# Altium project DARKYDEN.PrjPcb (part 8 of 17)

## Sheet SDCARD.SchDoc: DARKYDEN_SDCARD
size Letter; ApprovedBy: APPROUVÉ PAR; Author: Harold Malbrouck; Organization: Cegep Limoilou; Address1: 1300, 8e Avenue; Address2: Québec, QC; Address3: Canada; Address4: G1J 5L5; Revision: Rev.A; SheetNumber: 14; SheetTotal: 23
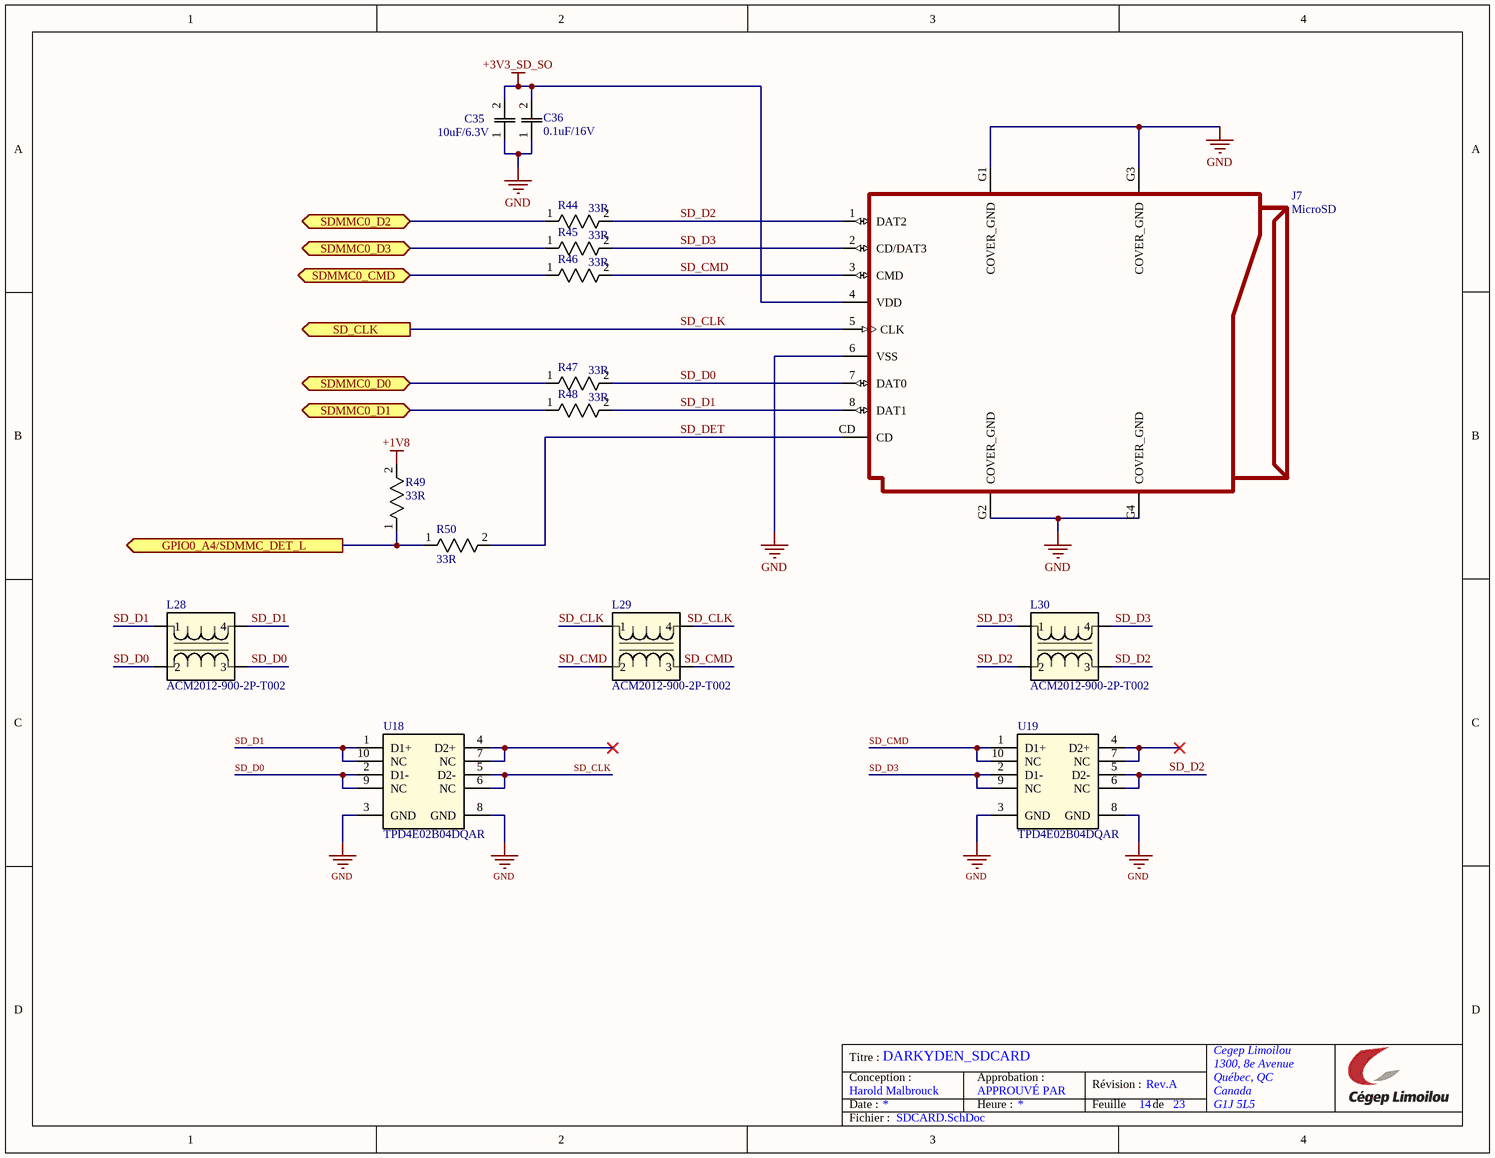
[diagram p7: SDCARD.SchDoc]

### Parts
C35  10uF/6.3V  [C0805]
C36  0.1uF/16V  [C0805]
J7  MicroSD  [CUI_MSD-4-A]
L28  ACM2012-900-2P-T002  [ACM20129002PT002]
L29  ACM2012-900-2P-T002  [ACM20129002PT002]
L30  ACM2012-900-2P-T002  [ACM20129002PT002]
R44  33R  [RESC1608X55N]
R45  33R  [RESC1608X55N]
R46  33R  [RESC1608X55N]
R47  33R  [RESC1608X55N]
R48  33R  [RESC1608X55N]
R49  33R  [RESC1608X55N]
R50  33R  [RESC1608X55N]
U18  TPD4E02B04DQAR  [DQA0010A]
U19  TPD4E02B04DQAR  [DQA0010A]

### Ports
GPIO0_A4/SDMMC_DET_L (out, see CONNECTEUR_4[3C]), SD_CLK (out, see CONNECTEUR_4[3B]), SDMMC0_CMD (bidir, see CONNECTEUR_4[3B]), SDMMC0_D0 (bidir, see CONNECTEUR_4[3B]), SDMMC0_D1 (bidir, see CONNECTEUR_4[3B]), SDMMC0_D2 (bidir, see CONNECTEUR_4[3B]), SDMMC0_D3 (bidir, see CONNECTEUR_4[3B])

### Nets
+1V8: R49.2
+3V3_SD_SO: C35.2 C36.2 J7.4(VDD)
GND: C35.1 C36.1 J7.6(VSS) J7.G1(COVER_GND) J7.G2(COVER_GND) J7.G3(COVER_GND) J7.G4(COVER_GND) U18.3(GND) U18.8(GND) U19.3(GND) U19.8(GND)
GPIO0_A4/SDMMC_DET_L: R49.1 R50.1 ; port GPIO0_A4/SDMMC_DET_L
SD_CLK: J7.5(CLK) L29.1 L29.4 U18.5(D2-) U18.6(NC) ; port SD_CLK
SD_CMD: J7.3(CMD) L29.2 L29.3 R46.2 U19.1(D1+) U19.10(NC)
SD_D0: J7.7(DAT0) L28.2 L28.3 R47.2 U18.2(D1-) U18.9(NC)
SD_D1: J7.8(DAT1) L28.1 L28.4 R48.2 U18.1(D1+) U18.10(NC)
SD_D2: J7.1(DAT2) L30.2 L30.3 R44.2 U19.5(D2-) U19.6(NC)
SD_D3: J7.2(CD/DAT3) L30.1 L30.4 R45.2 U19.2(D1-) U19.9(NC)
SD_DET: J7.CD R50.2
SDMMC0_CMD: R46.1 ; port SDMMC0_CMD
SDMMC0_D0: R47.1 ; port SDMMC0_D0
SDMMC0_D1: R48.1 ; port SDMMC0_D1
SDMMC0_D2: R44.1 ; port SDMMC0_D2
SDMMC0_D3: R45.1 ; port SDMMC0_D3
NetU18_4: U18.4(D2+) U18.7(NC)
NetU19_4: U19.4(D2+) U19.7(NC)

### Notes on the sheet
- Titre :
- Conception :
- Date :
- Approbation :
- Heure :
- Révision :
- Feuille
- de
- Fichier :

### Library data of the parts
C35 = C0805C106K9RACTU: as C2 on sheet USBC_A; Datasheet Link: https://content.kemet.com/datasheets/KEM_C1002_X7R_SMD.pdf; Height: 1.1mm; Manufacturer_Part_Number: C0805C106K9RACTU; Mouser Part Number: 80-C0805C106K9R; Mouser Price/Stock: https://www.mouser.co.uk/ProductDetail/KEMET/C0805C106K9RACTU?qs=iP0bYSAMAFo3iKcrfaqAag%3D%3D; Arrow Part Number: C0805C106K9RACTU; Arrow Price/Stock: https://www.arrow.com/en/products/c0805c106k9ractu/kemet-corporation?region=nac; Supplier: Digikey; Supplier Part Number: 399-C0805C106K9RACTUCT-ND; Manufacturer: KEMET; Manufacturer Part Number: C0805C106K9RACTU; RoHS: Yes; Category: Ceramic Capacitors; Stock: 12575; Pricing: 1=0.34, 10=0.203, 100=0.1327, 1000=0.0974 (USD); Mounting Technology: Surface Mount; Case/Package: 0805; Case Code (Metric): 2012; Case Code (Imperial): 0805; Dielectric Material: Ceramic; Min Operating Temperature: -55°C; Max Operating Temperature: 125°C; Package Quantity: 1; Tolerance: 10%; Packaging: Tape and Reel; Voltage Rating (DC): 6.3V; Dielectric: X7R; Termination: SMD/SMT; Series: C; Length: 2mm; Width: 0.049inch; Thickness: 0.055inch; Depth: 1.25mm; Reach SVHC Compliant: No; RoHS Compliant: Yes; ComponentLink1URL: http://www.farnell.com/datasheets/2745931.pdf?src-supplier=Farnell; ComponentLink1Description: http://www.farnell.com/datasheets/2745931.pdf?src-supplier=Farnell; ComponentLink2URL: http://www.mouser.com/ds/2/212/KEM_C1002_X7R_SMD-1102033.pdf?src-supplier=Mouser; ComponentLink2Description: http://www.mouser.com/ds/2/212/KEM_C1002_X7R_SMD-1102033.pdf?src-supplier=Mouser; ComponentLink3URL: http://datasheet.octopart.com/C0805C106K9RACTU-KEMET-datasheet-157246124.pdf?src-supplier=Avnet; ComponentLink3Description: http://datasheet.octopart.com/C0805C106K9RACTU-KEMET-datasheet-157246124.pdf?src-supplier=Avnet; ComponentLink4URL: http://datasheet.octopart.com/C0805C106K9RACTU-KEMET-datasheet-157246124.pdf?src-supplier=Verical; ComponentLink4Description: http://datasheet.octopart.com/C0805C106K9RACTU-KEMET-datasheet-157246124.pdf?src-supplier=Verical; ComponentLink5URL: http://datasheet.octopart.com/C0805C106K9RACTU-KEMET-datasheet-157246124.pdf?src-supplier=Onlinecomponents.com; ComponentLink5Description: http://datasheet.octopart.com/C0805C106K9RACTU-KEMET-datasheet-157246124.pdf?src-supplier=Onlinecomponents.com; ComponentLink6URL: http://components.arrow.com/part/dataview/53801129S170069N7429?src-supplier=Arrow+Electronics; ComponentLink6Description: http://components.arrow.com/part/dataview/53801129S170069N7429?src-supplier=Arrow+Electronics; ComponentLink7URL: http://www.farnell.com/datasheets/1828800.pdf?src-supplier=Newark; ComponentLink7Description: http://www.farnell.com/datasheets/1828800.pdf?src-supplier=Newark; ComponentLink8URL: http://datasheet.octopart.com/C0805C106K9RACTU-KEMET-datasheet-157246124.pdf?src-supplier=Digikey; ComponentLink8Description: http://datasheet.octopart.com/C0805C106K9RACTU-KEMET-datasheet-157246124.pdf?src-supplier=Digikey; ComponentLink9URL: https://api.kemet.com/component-edge/download/datasheet/C0805C106K9RACTU.pdf?src-supplier=Digikey; ComponentLink9Description: https://api.kemet.com/component-edge/download/datasheet/C0805C106K9RACTU.pdf?src-supplier=Digikey; ComponentLink10URL: http://www.farnell.com/datasheets/2745931.pdf?src-supplier=Element14; ComponentLink10Description: http://www.farnell.com/datasheets/2745931.pdf?src-supplier=Element14; ComponentLink11URL: https://datasheet.octopart.com/C0805C106K9RACTU-Kemet-datasheet-66076756.pdf?src-supplier=Element14; ComponentLink11Description: https://datasheet.octopart.com/C0805C106K9RACTU-Kemet-datasheet-66076756.pdf?src-supplier=Element14; ComponentLink12URL: http://datasheet.octopart.com/C0805C106K9RACTU-KEMET-datasheet-157246124.pdf?src-supplier=Rs; ComponentLink12Description: http://datasheet.octopart.com/C0805C106K9RACTU-KEMET-datasheet-157246124.pdf?src-supplier=Rs; ComponentLink13URL: http://www.farnell.com/datasheets/1791936.pdf?src-supplier=Newark; ComponentLink13Description: http://www.farnell.com/datasheets/1791936.pdf?src-supplier=Newark; ComponentLink14URL: http://datasheet.octopart.com/C0805C106K9RACTU-KEMET-datasheet-157246124.pdf?src-supplier=Electro+Sonic; ComponentLink14Description: http://datasheet.octopart.com/C0805C106K9RACTU-KEMET-datasheet-157246124.pdf?src-supplier=Electro+Sonic; ComponentLink15URL: https://datasheet.octopart.com/C0805C106K9RACTU-KEMET-datasheet-157246124.pdf?src-supplier=TME; ComponentLink15Description: https://datasheet.octopart.com/C0805C106K9RACTU-KEMET-datasheet-157246124.pdf?src-supplier=TME; ComponentLink16URL: http://datasheet.octopart.com/C0805C106K9RACTU-KEMET-datasheet-157246124.pdf?src-supplier=NAC+Semi; ComponentLink16Description: http://datasheet.octopart.com/C0805C106K9RACTU-KEMET-datasheet-157246124.pdf?src-supplier=NAC+Semi
C36 = C0805C104K4RACAUTO: as C29 on sheet NVME; Supplier: Digikey; Supplier Part Number: 399-C0805C104K4RACAUTOCT-ND; Manufacturer: KEMET; Manufacturer Part Number: C0805C104K4RACAUTO; RoHS: Yes; Category: Ceramic Capacitors; Stock: 27573; Pricing: 1=0.19, 10=0.108, 100=0.0672, 1000=0.04624 (USD); Case/Package: 0805; Dielectric Material: 4241ConductorMaterial; Min Operating Temperature: -55°C; Max Operating Temperature: 125°C; Tolerance: 10%; Packaging: Tape and Reel; Dielectric: X7R; Voltage Rating (DC): 16V; Length: 2mm; Depth: 1.25mm; RoHS Compliant: Yes
J7 = MSD-4-A: Micro SD Card Connector, 9 Positions, Connector and Ejector, Push In, Auto Eject Out, Surface Mount, 1.8 mm Height Above Board, Gold Flash; MF: Same Sky; SnapEDA_Link: https://www.snapeda.com/parts/MSD-4-A/Same+Sky/view-part/?ref=snap; Package: None; Value: *; MP: MSD-4-A; Check_prices: https://www.snapeda.com/parts/MSD-4-A/Same+Sky/view-part/?ref=eda
L28-L30 = ACM2012-900-2P-T002: as L1 on sheet USBC_A; Datasheet Link: https://product.tdk.com/system/files/dam/doc/product/emc/emc/cmf_cmc/catalog/cmf_commercial_signal_acm2012_en.pdf; Height: 1.3mm; Manufacturer_Part_Number: ACM2012-900-2P-T002; Mouser Part Number: 810-ACM20129002PT002; Mouser Price/Stock: https://www.mouser.co.uk/ProductDetail/TDK/ACM2012-900-2P-T002?qs=vhEaPADELPHXWaCJFQVZjQ%3D%3D; Arrow Part Number: ACM2012-900-2P-T002; Arrow Price/Stock: https://www.arrow.com/en/products/acm2012-900-2p-t002/tdk?utm_currency=USD&region=europe; Supplier: Digikey; Supplier Part Number: 445-2207-1-ND; Manufacturer: TDK; Manufacturer Part Number: ACM2012-900-2P-T002; RoHS: Yes; Category: Common Mode Chokes; Stock: 26254; Pricing: 1=0.34, 10=0.277, 25=0.2564, 50=0.2416, 100=0.2278, 250=0.21076, 500=0.1987, 1000=0.18735 (USD); Mounting Technology: Surface Mount; Case/Package: 0805; Pins: 4; Case Code (Metric): 2012; Case Code (Imperial): 0805; Core Material: Ferrite; Min Operating Temperature: -40°C; Max Operating Temperature: 85°C; Packaging: Tape and Reel; Package Quantity: 1; Voltage Rating (DC): 50V; Current Rating: 400mA; Max DC Current: 400mA; Termination: SMD/SMT; Test Frequency: 100MHz; Current: 400mA; DC Current: 400mA; Series: ACM; DC Resistance-Max: 190mR; Max Current Rating: 400mA; RMS Current (Irms): 400mA; ESR: 190mR; Coil Resistance: 190mR; Length: 2.2mm; Width: 0.047inch; Depth: 1.4mm; Radiation Hardening: No; Reach SVHC Compliant: No; Military Standard: Not; RoHS Compliant: Yes; Lead Free: 5697LeadFree; ComponentLink1URL: https://datasheet.ciiva.com/26946/getdatasheetpartid-664745-26946491.pdf?src-supplier=Verical; ComponentLink1Description: https://datasheet.ciiva.com/26946/getdatasheetpartid-664745-26946491.pdf?src-supplier=Verical; ComponentLink2URL: https://datasheet.ciiva.com/1127/1750020-1127257.pdf?src-supplier=Element14; ComponentLink2Description: https://datasheet.ciiva.com/1127/1750020-1127257.pdf?src-supplier=Element14; ComponentLink3URL: https://datasheet.ciiva.com/22726/1750020-22726278.pdf?src-supplier=Element14; ComponentLink3Description: https://datasheet.ciiva.com/22726/1750020-22726278.pdf?src-supplier=Element14; ComponentLink4URL: https://datasheet.ciiva.com/28428/1750020-28428616.pdf?src-supplier=Element14; ComponentLink4Description: https://datasheet.ciiva.com/28428/1750020-28428616.pdf?src-supplier=Element14; ComponentLink5URL: https://datasheet.ciiva.com/46450/1750020-46450939.pdf?src-supplier=Element14; ComponentLink5Description: https://datasheet.ciiva.com/46450/1750020-46450939.pdf?src-supplier=Element14; ComponentLink6URL: https://datasheet.ciiva.com/1007/e9712-acm-1007624.pdf?src-supplier=Digikey; ComponentLink6Description: https://datasheet.ciiva.com/1007/e9712-acm-1007624.pdf?src-supplier=Digikey; ComponentLink7URL: https://datasheet.ciiva.com/1007/e9712-acm-1007623.pdf?src-supplier=Digikey; ComponentLink7Description: https://datasheet.ciiva.com/1007/e9712-acm-1007623.pdf?src-supplier=Digikey; ComponentLink8URL: https://datasheet.ciiva.com/1007/e9712-acm-1007625.pdf?src-supplier=Digikey; ComponentLink8Description: https://datasheet.ciiva.com/1007/e9712-acm-1007625.pdf?src-supplier=Digikey; ComponentLink9URL: https://datasheet.ciiva.com/4941/tdk-e9712-acm-332263-4941941.pdf?src-supplier=Mouser; ComponentLink9Description: https://datasheet.ciiva.com/4941/tdk-e9712-acm-332263-4941941.pdf?src-supplier=Mouser; ComponentLink10URL: https://datasheet.ciiva.com/16416/e9712-acm-16416522.pdf?src-supplier=Future+Electronics; ComponentLink10Description: https://datasheet.ciiva.com/16416/e9712-acm-16416522.pdf?src-supplier=Future+Electronics; ComponentLink11URL: https://datasheet.ciiva.com/8498/e9712-acm-8498823.pdf?src-supplier=Avnet; ComponentLink11Description: https://datasheet.ciiva.com/8498/e9712-acm-8498823.pdf?src-supplier=Avnet; ComponentLink12URL: https://datasheet.ciiva.com/16382/e9712-acm-16382582.pdf?src-supplier=Future+Electronics; ComponentLink12Description: https://datasheet.ciiva.com/16382/e9712-acm-16382582.pdf?src-supplier=Future+Electronics
R44-R50 = ERJ-3EKF33R0V: as R28 on sheet NVME; Supplier: Digikey; Supplier Part Number: P33.0HCT-ND; Manufacturer: Panasonic; Manufacturer Part Number: ERJ-3EKF33R0V; RoHS: Yes; Category: Chip SMD Resistors; Stock: 430721; Pricing: 1=0.1, 10=0.035, 100=0.0177, 1000=0.01014, 2500=0.00888 (USD); Mounting Technology: Surface Mount; Case/Package: 0603; Pins: 2; Case Code (Metric): 1608; Case Code (Imperial): 0603; Contact Plating: Tin; Min Operating Temperature: -55°C; Max Operating Temperature: 155°C; Value: 33R; Tolerance: 1%; Packaging: Tape and Reel; Package Quantity: 1; Resistor Type: Thick Film; Number of Terminations: 2; Temperature Coefficient: 100ppm/°C; Termination: SMD/SMT; Max Power Dissipation: 100mW; Voltage Rating (DC): 75V; Features: Automotive AEC-Q200; Series: ERJ; Construction: Rectangular; Resistance Tolerance: 1%; Length: 1.6mm; Width: 0.8mm; Height: 0.022inch; Depth: 0.8mm; Radiation Hardening: No; Reach SVHC Compliant: No; Military Standard: Not; Lead Free: Lead Free; RoHS Compliant: Yes; ComponentLink1URL: https://datasheet.ciiva.com/5917/aoa0000ce2-5917831.pdf?src-supplier=Farnell; ComponentLink1Description: https://datasheet.ciiva.com/5917/aoa0000ce2-5917831.pdf?src-supplier=Farnell; ComponentLink2URL: https://datasheet.ciiva.com/48531/aoa0000ce2-48531007.pdf?src-supplier=Avnet; ComponentLink2Description: https://datasheet.ciiva.com/48531/aoa0000ce2-48531007.pdf?src-supplier=Avnet; ComponentLink3URL: https://datasheet.ciiva.com/30250/aoa0000ce2-30250862.pdf?src-supplier=Onlinecomponents.com; ComponentLink3Description: https://datasheet.ciiva.com/30250/aoa0000ce2-30250862.pdf?src-supplier=Onlinecomponents.com; ComponentLink4URL: https://datasheet.ciiva.com/16778/70260748-16778478.pdf?src-supplier=Allied+Electronics; ComponentLink4Description: https://datasheet.ciiva.com/16778/70260748-16778478.pdf?src-supplier=Allied+Electronics; ComponentLink5URL: https://datasheet.ciiva.com/16781/70260748-16781237.pdf?src-supplier=Allied+Electronics; ComponentLink5Description: https://datasheet.ciiva.com/16781/70260748-16781237.pdf?src-supplier=Allied+Electronics; ComponentLink6URL: https://datasheet.ciiva.com/22673/1678782-22673288.pdf?src-supplier=Element14; ComponentLink6Description: https://datasheet.ciiva.com/22673/1678782-22673288.pdf?src-supplier=Element14; ComponentLink7URL: https://datasheet.ciiva.com/24026/aoa0000ce2-24026635.pdf?src-supplier=Mouser; ComponentLink7Description: https://datasheet.ciiva.com/24026/aoa0000ce2-24026635.pdf?src-supplier=Mouser; ComponentLink8URL: https://datasheet.ciiva.com/22687/1678782-22687390.pdf?src-supplier=Element14; ComponentLink8Description: https://datasheet.ciiva.com/22687/1678782-22687390.pdf?src-supplier=Element14; ComponentLink9URL: https://datasheet.ciiva.com/7836/aoa0000ce2-7836503.pdf?src-supplier=Element14; ComponentLink9Description: https://datasheet.ciiva.com/7836/aoa0000ce2-7836503.pdf?src-supplier=Element14; ComponentLink10URL: https://datasheet.ciiva.com/7836/426256-7836821.pdf?src-supplier=Element14; ComponentLink10Description: https://datasheet.ciiva.com/7836/426256-7836821.pdf?src-supplier=Element14
U18 U19 = TPD4E02B04DQAR: as U4 on sheet USBC_A; TYPE: TYPE; RefDes: RefDes; Application_BuildNumber: *; PartNumber: TPD4E02B04DQAR; PackageReference: DQA0010A; MountType: SMT; RoHS: Y; Manufacturer: Texas Instruments; Supplier: Digikey; Supplier Part Number: 296-43875-1-ND; Manufacturer Part Number: TPD4E02B04DQAR; Category: Integrated Circuits (ICs); Mounting Technology: Surface Mount; Pins: 10; Min Operating Temperature: -40°C; Max Operating Temperature: 125°C; Packaging: Cut Tape; Reverse Standoff Voltage: 3.6V; Operating Supply Voltage: 3.6V; Number of Channels: 4; Series: -; Length: 2.5mm; Width: 1mm; Height: 550um; Thickness: 500um; Reach SVHC Compliant: No; Lead Free: Lead Free; RoHS Compliant: Yes; ComponentLink1URL: http://www.ti.com/lit/ds/symlink/tpd4e02b04.pdf?src-supplier=Digikey; ComponentLink1Description: http://www.ti.com/lit/ds/symlink/tpd4e02b04.pdf?src-supplier=Digikey; ComponentLink2URL: http://www.ti.com/lit/ds/symlink/tpd4e02b04.pdf?src-supplier=Farnell; ComponentLink2Description: http://www.ti.com/lit/ds/symlink/tpd4e02b04.pdf?src-supplier=Farnell; ComponentLink3URL: http://www.ti.com/lit/ds/symlink/tpd4e02b04.pdf?src-supplier=Newark; ComponentLink3Description: http://www.ti.com/lit/ds/symlink/tpd4e02b04.pdf?src-supplier=Newark; ComponentLink4URL: http://www.ti.com/general/docs/lit/getliterature.tsp?genericPartNumber=TPD4E02B04&amp;&amp;fileType=pdf&src-supplier=Element14; ComponentLink4Description: http://www.ti.com/general/docs/lit/getliterature.tsp?genericPartNumber=TPD4E02B04&amp;&amp;fileType=pdf&src-supplier=Element14

## Sheet eDP.SchDoc: DARKYDEN_eDP
size Letter; ApprovedBy: APPROUVÉ PAR; Author: Harold Malbrouck; Organization: Cegep Limoilou; Address1: 1300, 8e Avenue; Address2: Québec, QC; Address3: Canada; Address4: G1J 5L5; Revision: Rev.A; SheetNumber: 16; SheetTotal: 23
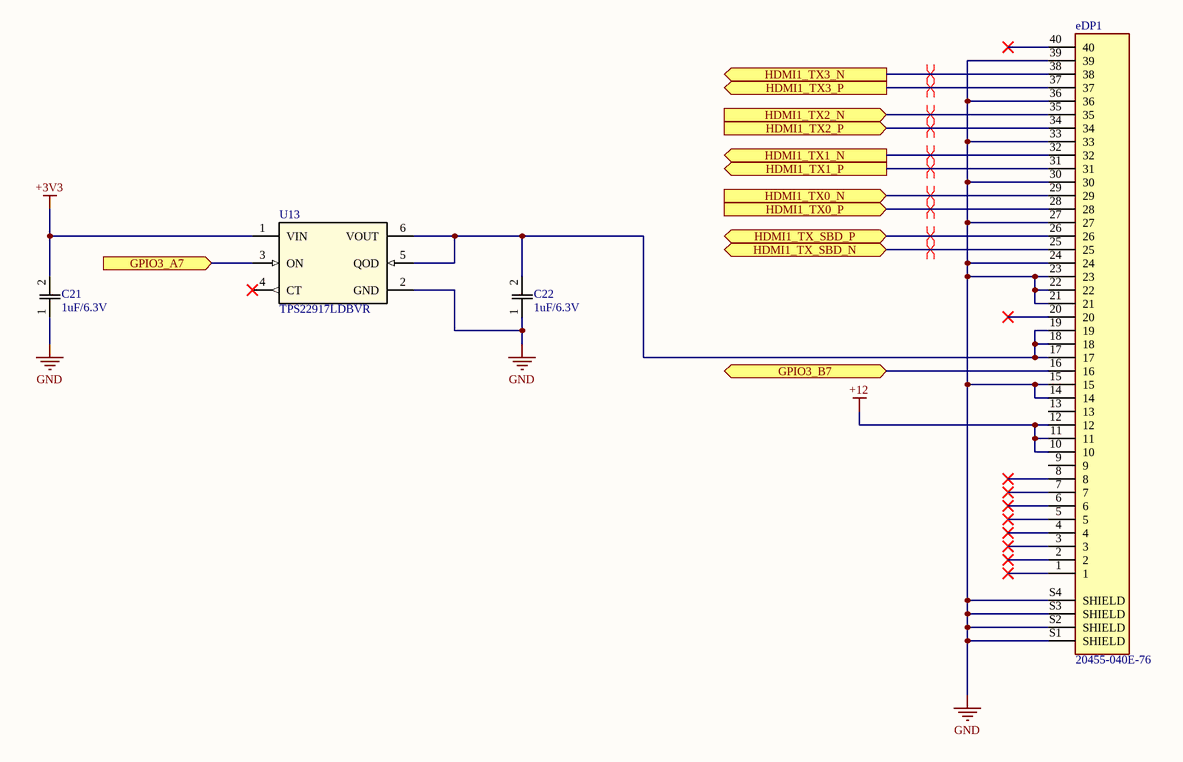
[diagram p8: eDP.SchDoc]

### Parts
C21  1uF/6.3V  [C0805]
C22  1uF/6.3V  [C0805]
eDP1  20455-040E-76  [IPEX_20455-040E-76]
U13  TPS22917LDBVR  [DBV0006_L]

### Ports
GPIO3_A7 (in, see CONNECTEUR_4[3C]), GPIO3_B7 (bidir, see CONNECTEUR_4[3C]), HDMI1_TX0_N (in, see CONNECTEUR_4[1A]), HDMI1_TX0_P (in, see CONNECTEUR_4[1A]), HDMI1_TX1_N (out, see CONNECTEUR_4[1A]), HDMI1_TX1_P (out, see CONNECTEUR_4[1A]), HDMI1_TX2_N (in, see CONNECTEUR_4[1A]), HDMI1_TX2_P (in, see CONNECTEUR_4[1A]), HDMI1_TX3_N (out, see CONNECTEUR_4[1A]), HDMI1_TX3_P (out, see CONNECTEUR_4[1A]), HDMI1_TX_SBD_N (bidir, see CONNECTEUR_4[1B]), HDMI1_TX_SBD_P (bidir, see CONNECTEUR_4[1B])

### Nets
+3V3: C21.2 U13.1(VIN)
+12: eDP1.10 eDP1.11 eDP1.12
GND: C21.1 C22.1 eDP1.14 eDP1.15 eDP1.21 eDP1.22 eDP1.23 eDP1.24 eDP1.27 eDP1.30 eDP1.33 eDP1.36 eDP1.39 eDP1.S1(SHIELD) eDP1.S2(SHIELD) eDP1.S3(SHIELD) eDP1.S4(SHIELD) U13.2(GND)
GPIO3_A7: U13.3(ON) ; port GPIO3_A7
GPIO3_B7: eDP1.16 ; port GPIO3_B7
HDMI1_TX0_N: eDP1.29 ; port HDMI1_TX0_N
HDMI1_TX0_P: eDP1.28 ; port HDMI1_TX0_P
HDMI1_TX1_N: eDP1.32 ; port HDMI1_TX1_N
HDMI1_TX1_P: eDP1.31 ; port HDMI1_TX1_P
HDMI1_TX2_N: eDP1.35 ; port HDMI1_TX2_N
HDMI1_TX2_P: eDP1.34 ; port HDMI1_TX2_P
HDMI1_TX3_N: eDP1.38 ; port HDMI1_TX3_N
HDMI1_TX3_P: eDP1.37 ; port HDMI1_TX3_P
HDMI1_TX_SBD_N: eDP1.25 ; port HDMI1_TX_SBD_N
HDMI1_TX_SBD_P: eDP1.26 ; port HDMI1_TX_SBD_P
NetC22_2: C22.2 eDP1.17 eDP1.18 eDP1.19 U13.5(QOD) U13.6(VOUT)

Not connected (* = marked no-connect by the designer): eDP1 1* 2* 3* 4* 5* 6* 7* 8* 9 13 20* 40*; U13 4(CT)*

### Layout directives
differential pair; differential pair class eDP: HDMI1_TX0_N, HDMI1_TX0_P, HDMI1_TX1_N, HDMI1_TX1_P, HDMI1_TX2_N, HDMI1_TX2_P, HDMI1_TX3_N, HDMI1_TX3_P, HDMI1_TX_SBD_N, HDMI1_TX_SBD_P

### Notes on the sheet
- Titre :
- Conception :
- Date :
- Approbation :
- Heure :
- Révision :
- Feuille
- de
- Fichier :

### Library data of the parts
C21 C22 = C0805C105K9RACTU: as C8 on sheet USBC_A; Datasheet Link: https://content.kemet.com/datasheets/KEM_C1002_X7R_SMD.pdf; Height: 1.1mm; Manufacturer_Part_Number: C0805C105K9RACTU; Mouser Part Number: 80-C0805C105K9R; Mouser Price/Stock: https://www.mouser.co.uk/ProductDetail/KEMET/C0805C105K9RACTU?qs=Nnkldhwoc36daYb4WU%2Fecw%3D%3D; Arrow Part Number: C0805C105K9RACTU; Arrow Price/Stock: https://www.arrow.com/en/products/c0805c105k9ractu/kemet-corporation?utm_currency=USD&region=nac; Supplier: Digikey; Supplier Part Number: 399-13161-1-ND; Manufacturer: KEMET; Manufacturer Part Number: C0805C105K9RACTU; RoHS: Yes; Category: Ceramic Capacitors; Stock: 8847; Pricing: 1=0.49, 10=0.397, 100=0.3017, 1000=0.24335, 2500=0.22102, 5000=0.20619, 7500=0.16784, 12500=0.12939, 17500=0.02492, 25000=0.02414, 62500=0.02244, 125000=0.02142, 250000=0.02059 (USD); Mounting Technology: Surface Mount; Case/Package: 0805; Case Code (Metric): 2012; Case Code (Imperial): 0805; Dielectric Material: Ceramic; Min Operating Temperature: -55°C; Max Operating Temperature: 125°C; Packaging: Tape and Reel; Tolerance: 10%; Package Quantity: 4000; Voltage Rating (DC): 6.3V; Dielectric: X7R; Termination: SMD/SMT; Series: C0805C; Construction: Flat; Length: 2mm; Width: 1.2mm; Thickness: 0.039inch; Lead Pitch: 0.75mm; Depth: 1.25mm; Radiation Hardening: No; RoHS Compliant: Yes; ComponentLink1URL: https://datasheet.ciiva.com/5416/kem-c1002-x7r-smd-5416463.pdf?src-supplier=Mouser; ComponentLink1Description: https://datasheet.ciiva.com/5416/kem-c1002-x7r-smd-5416463.pdf?src-supplier=Mouser
eDP1 = 20455-040E-76: Conn Wire to Board RCP 40 POS 0.5mm Solder RA Side Entry SMDCABLINE® T/R; Manufacturer: I-PEX; Package: None; Price: None; Value: *; MP: 20455-040E-76; Availability: Unavailable; Supplier: Digikey; Supplier Part Number: 5378-20455-040E-76CT-ND; Manufacturer Part Number: 20455-040E-76; RoHS: No; Category: FFC / FPC; Stock: 7447; Pricing: 1=2.21, 10=1.878, 25=1.7604, 50=1.6764, 100=1.5962, 250=1.49624, 500=1.4248, 1000=1.377 (USD); RoHS Compliant: No; ComponentLink1URL: https://datasheet.octopart.com/20455-040E-76-I-PEX-datasheet-154856138.pdf?src-supplier=Future+Electronics; ComponentLink1Description: https://datasheet.octopart.com/20455-040E-76-I-PEX-datasheet-154856138.pdf?src-supplier=Future+Electronics; ComponentLink2URL: http://datasheet.octopart.com/20455-040E-76-I-PEX-datasheet-154856138.pdf?src-supplier=Quest; ComponentLink2Description: http://datasheet.octopart.com/20455-040E-76-I-PEX-datasheet-154856138.pdf?src-supplier=Quest
U13 = TPS22917LDBVR: 5.5-V, 2-A, 80-mΩ , 10-nA leakage load switch adj. rise time and adj output discharge 6-SOT-23 -45 to 125; Mfr_Name: Texas Instruments; TYPE: TYPE; RefDes: RefDes; Supplier: Digikey; Supplier Part Number: 296-TPS22917LDBVRCT-ND; Manufacturer: Texas Instruments; Manufacturer Part Number: TPS22917LDBVR; RoHS: No; Category: Integrated Circuits (ICs); Stock: 10229; Pricing: 1=0.41, 10=0.284, 25=0.2528, 100=0.2188, 250=0.20248, 500=0.1927, 1000=0.18463 (USD); Case/Package: 926Case; Pins: 6NUMBER; Length: 2.9mm; Width: 1.6mm; Thickness: 1.2mm